# EAGLE design au6850_mp3 (EAGLE 9.0.0)
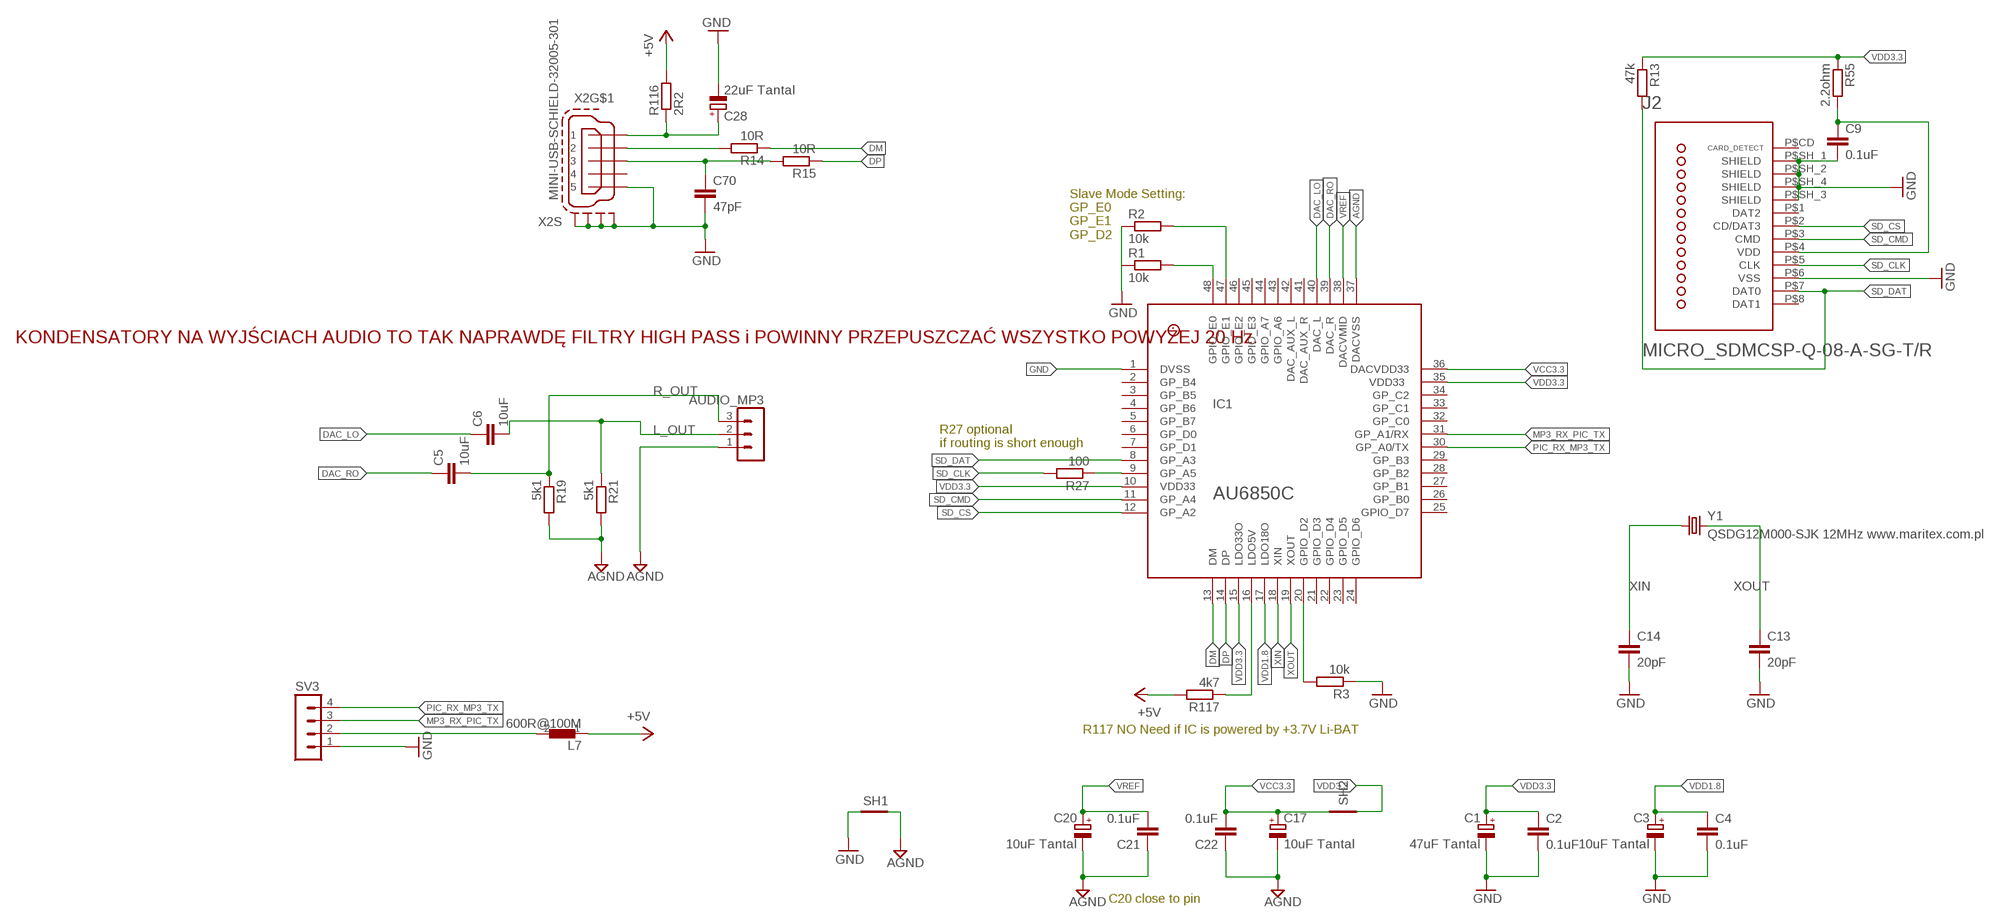
[diagram p0: schematic, sheet 1]

## Parts
AUDIO_MP3  MA03-1  [MA03-1]
C1  47uF Tantal  CPOL-EUB/3528-21R  [B/3528-21R]
C2  0.1uF  C-EUC0805  [C0805]
C3  10uF Tantal  CPOL-EUB/3528-21R  [B/3528-21R]
C4  0.1uF  C-EUC0805  [C0805]
C5  10uF  C-EUC0805  [C0805]
C6  10uF  C-EUC0805  [C0805]
C9  0.1uF  C-EUC0805  [C0805]
C13  20pF  C-EUC0805  [C0805]
C14  20pF  C-EUC0805  [C0805]
C17  10uF Tantal  CPOL-EUB/3528-21R  [B/3528-21R]
C20  10uF Tantal  CPOL-EUB/3528-21R  [B/3528-21R]
C21  0.1uF  C-EUC0805  [C0805]
C22  0.1uF  C-EUC0805  [C0805]
C28  22uF Tantal  CPOL-EUSMCA  [SMC_A]
C70  47pF  C-EUC0805  [C0805]
IC1  AU6850C  [LQFP48-7X7]
J2  MICRO_SDMCSP-Q-08-A-SG-T/R  [MICRO_SD_8PINS]
L7  600R@100M  FERRITR0805  [R0805]
R1  10k  R-EU_R0805  [R0805]
R2  10k  R-EU_R0805  [R0805]
R3  10k  R-EU_R0805  [R0805]
R13  47k  R-EU_R0805  [R0805]
R14  10R  R-EU_R0805  [R0805]
R15  10R  R-EU_R0805  [R0805]
R19  5k1  R-EU_R0805  [R0805]
R21  5k1  R-EU_R0805  [R0805]
R27  100  R-EU_R0805  [R0805]
R55  2.2ohm  R-EU_R0805  [R0805]
R116  2R2  R-EU_R0805  [R0805]
R117  4k7  R-EU_R0805  [R0805]
SH1  SHORT-HT5  [SHORT_TOP-50]
SH2  SHORT-V12_MILS  [12_MILS]
SV3  MA04-1  [MA04-1]
X2  MINI-USB-SCHIELD-32005-301  [32005-301]
Y1  QSDG12M000-SJK 12MHz www.maritex.com.pl  CRYSTALTXC-7A  [CRYSTAL-TXC-7A]

## Nets
+5V: L7.1 R116.2 R117.2
AGND: AUDIO_MP3.1 C17.- C20.- C21.1 C22.1 IC1.37(DACVSS) R19.2 R21.2 SH1.2
DAC_LO: C6.1 IC1.40(DAC_L)
DAC_RO: C5.1 IC1.39(DAC_R)
DM: IC1.13(DM) R14.1
DP: IC1.14(DP) R15.1
GND: C1.- C2.2 C3.- C4.2 C9.2 C13.2 C14.2 C28.- C70.2 IC1.1(DVSS) J2.P$6(VSS) J2.P$SH_1(1_GND_PAD) J2.P$SH_2(2_GND_PAD) J2.P$SH_3(3_GND_PAD) J2.P$SH_4(4_GND_PAD) R1.1 R2.1 R3.1 SH1.1 SV3.1 X2.5 X2.M1(S:S1) X2.M2(S:S2) X2.M3(S:S3) X2.M4(S:S4)
L_OUT: AUDIO_MP3.2 C6.2 R21.1
MP3_RX_PIC_TX: IC1.31(GP_A1/RX) SV3.3
N$4: IC1.16(LDO5V) R117.1
N$5: IC1.9(GP_A5) R27.1
N$8: C28.+ R116.1 X2.1
N$9: C70.1 R15.2 X2.3
N$10: R14.2 X2.2
N$13: L7.2 SV3.2
N$14: C9.1 J2.P$4(VDD) R55.2
PIC_RX_MP3_TX: IC1.30(GP_A0/TX) SV3.4
R_OUT: AUDIO_MP3.3 C5.2 R19.1
SD_CLK: J2.P$5(CLK) R27.2
SD_CMD: IC1.11(GP_A4) J2.P$3(CMD)
SD_CS: IC1.12(GP_A2) J2.P$2(CD/DAT3)
SD_DAT: IC1.8(GP_A3) J2.P$7(DAT0) R13.2
SLAVE_D2: IC1.20(GPIO_D2) R3.2
SLAVE_E0: IC1.48(GPIO_E0) R1.2
SLAVE_E1: IC1.47(GPIO_E1) R2.2
VCC3.3: C17.+ C22.2 IC1.36(DACVDD33) SH2.P$2
VDD1.8: C3.+ C4.1 IC1.17(LDO18O)
VDD3.3: C1.+ C2.1 IC1.10(VDD33) IC1.15(LDO33O) IC1.35(VDD33) R13.1 R55.1 SH2.P$1
VREF: C20.+ C21.2 IC1.38(DACVMID)
XIN: C14.1 IC1.18(XIN) Y1.P$1
XOUT: C13.1 IC1.19(XOUT) Y1.P$2
Unconnected: IC1.2(GP_B4) IC1.3(GP_B5) IC1.4(GP_B6) IC1.5(GP_B7) IC1.6(GP_D0) IC1.7(GP_D1) IC1.21(GPIO_D3) IC1.22(GPIO_D4) IC1.23(GPIO_D5) IC1.24(GPIO_D6) IC1.25(GPIO_D7) IC1.26(GP_B0) IC1.27(GP_B1) IC1.28(GP_B2) IC1.29(GP_B3) IC1.32(GP_C0) IC1.33(GP_C1) IC1.34(GP_C2) IC1.41(DAC_AUX_R) IC1.42(DAC_AUX_L) IC1.43(GPIO_A6) IC1.44(GPIO_A7) IC1.45(GPIO_E3) IC1.46(GPIO_E2) J2.P$1(DAT2) J2.P$8(DAT1) J2.P$CD(CARD_DETECT_SW) X2.4

## Notes on the sheet
- Slave Mode Setting:
  GP_E0
  GP_E1
  GP_D2
- KONDENSATORY NA WYJŚCIACH AUDIO TO TAK NAPRAWDĘ FILTRY HIGH PASS i POWINNY PRZEPUSZCZAĆ WSZYSTKO POWYŻEJ 20 Hz.
- R27 optional
  if routing is short enough
- R117 NO Need if IC is powered by +3.7V Li-BAT
- C20 close to pin

## Library data of the parts
AUDIO_MP3 = con-lstb:MA03-1: PIN HEADER; OC_FARNELL: unknown; OC_NEWARK: unknown
C1 C3 C17 C20 C28 = rcl:CPOL-EU: POLARIZED CAPACITOR, European symbol
C2 C4-C6 C21 C22 = rcl:C-EU: CAPACITOR, European symbol
C9 C13 C14 C70 = resistor:C-EU: CAPACITOR, European symbol
IC1 = mvsilicon:AU6850C
J2 = ADAM_TECH_SD_Card:MICRO_SD: Adam Tech
L7 = ferrit_bear:FERRIT
R1-R3 R13-R15 R19 R21 R27 R55 R116 R117 = rcl:R-EU_: RESISTOR, European symbol
SH1 = shorts-old:SHORT-H: Short between two nets; BOM: no
SH2 = shorts-old:SHORT-V: Short between two nets
SV3 = con-lstb:MA04-1: PIN HEADER; OC_FARNELL: unknown; OC_NEWARK: unknown
X2 = con-cypressindustries:MINI-USB-SCHIELD-: MINI USB-B Conector Source: www.cypressindustries.com; OC_FARNELL: unknown; OC_NEWARK: unknown
Y1 = SparkFun-FreqCtrl:CRYSTAL: Various standard crystals. Proven footprints. Spark Fun Electronics SKU : COM-00534

## Board
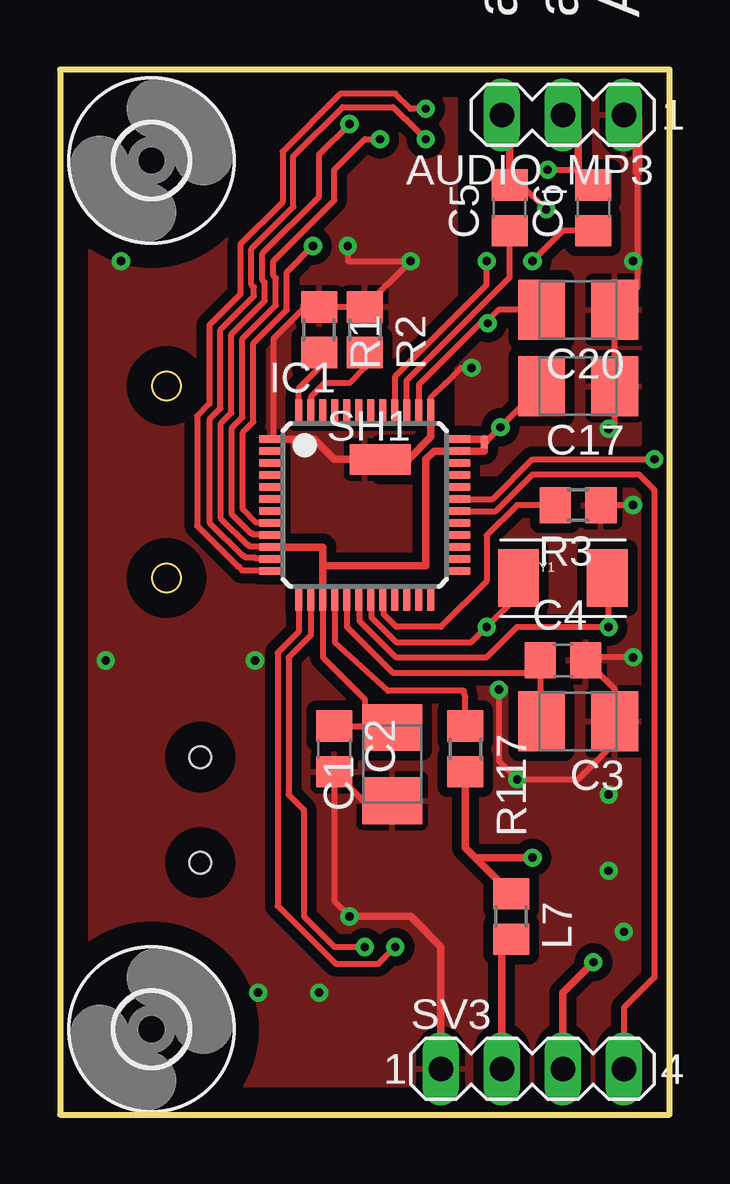
[diagram p1: board, top side]
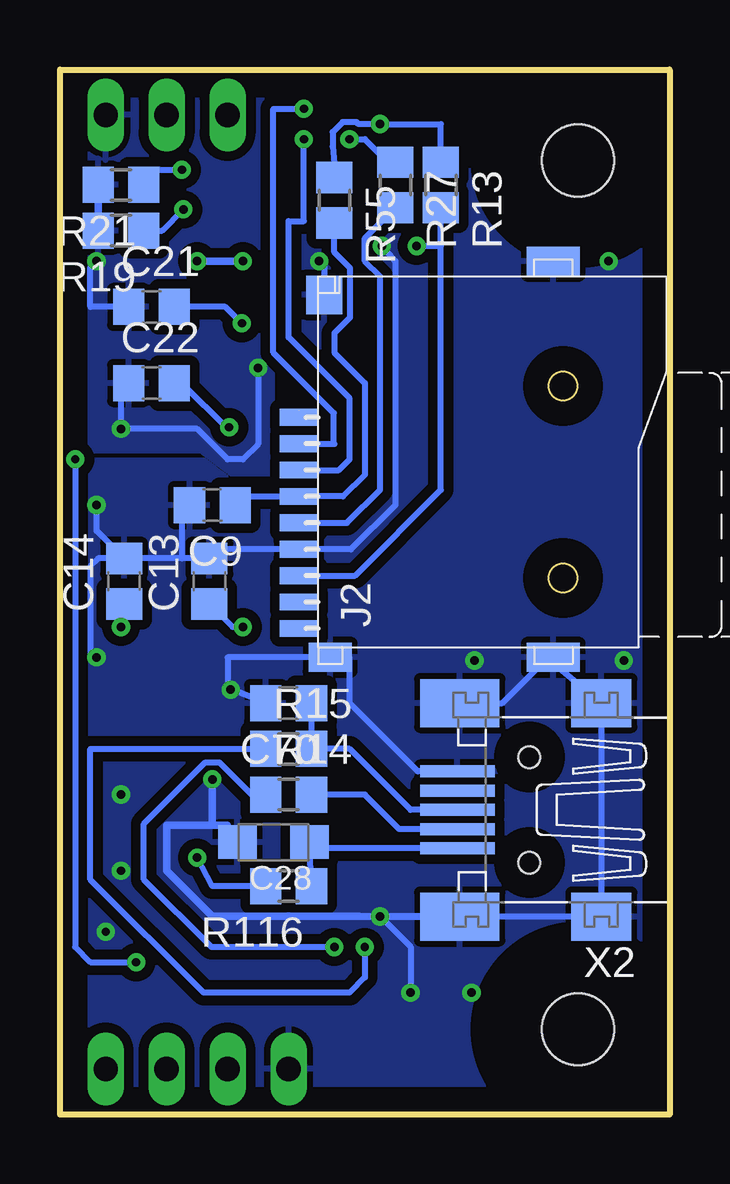
[diagram p2: board, bottom side, seen from below]

Size 25.4 x 43.54 mm. Coordinates in mm from the lower left corner, seen from the top.
Outline: 0,0 25.4,0 25.4,43.54 0,43.54 0,0
Copper layers (1*16): Top 0.035mm / dielectric 1.5mm / Bottom 0.035mm
Design rules "default *": minimum track width 10mil, minimum drill 24mil, track to track 8mil, track to pad 8mil, pad to pad 8mil, via to via 8mil, smd to smd 8mil, copper to edge 40mil, drill to drill 8mil, minimum pad ring 10mil, minimum via ring 8mil, stop-mask expansion 4mil, vias tented up to drill 0mil, thermal gap 10mil

### Footprints (pad centres in the part's own frame; a part is rotated, then mirrored left to right if it is on the bottom)
MA03-1 = drill 1.016 long: 1 -2.54,0; 2 0,0; 3 2.54,0
B/3528-21R = smd 1.95 x 2.5: + 1.525,0; - -1.525,0
C0805 = smd 1.3 x 1.5: 1 -0.95,0; 2 0.95,0
SMC_A = smd 1.6 x 1.4: + -1.5,0; - 1.5,0
LQFP48-7X7 = smd 0.9 x 0.3: 1 -3.95,2.75; 2 -3.95,2.25; 3 -3.95,1.75; 4 -3.95,1.25; 5 -3.95,0.75; 6 -3.95,0.25; 7 -3.95,-0.25; 8 -3.95,-0.75; 9 -3.95,-1.25; 10 -3.95,-1.75; 11 -3.95,-2.25; 12 -3.95,-2.75; 25 3.95,-2.75; 26 3.95,-2.25; 27 3.95,-1.75; 28 3.95,-1.25; 29 3.95,-0.75; 30 3.95,-0.25; 31 3.95,0.25; 32 3.95,0.75; 33 3.95,1.25; 34 3.95,1.75; 35 3.95,2.25; 36 3.95,2.75 | smd 0.3 x 0.9: 13 -2.75,-3.95; 14 -2.25,-3.95; 15 -1.75,-3.95; 16 -1.25,-3.95; 17 -0.75,-3.95; 18 -0.25,-3.95; 19 0.25,-3.95; 20 0.75,-3.95; 21 1.25,-3.95; 22 1.75,-3.95; 23 2.25,-3.95; 24 2.75,-3.95; 37 2.75,3.95; 38 2.25,3.95; 39 1.75,3.95; 40 1.25,3.95; 41 0.75,3.95; 42 0.25,3.95; 43 -0.25,3.95; 44 -0.75,3.95; 45 -1.25,3.95; 46 -1.75,3.95; 47 -2.25,3.95; 48 -2.75,3.95
MICRO_SD_8PINS = smd 0.7 x 1.6: P$1 1.75,11; P$2 0.65,11; P$3 -0.45,11; P$4 -1.55,11; P$5 -2.65,11; P$6 -3.75,11; P$7 -4.85,11; P$8 -5.95,11; P$CD -7.05,11 | smd 1.2 x 2.2: P$SH_1 -8.25,0.4; P$SH_2 8.25,0.4 | smd 1.2 x 1.8: P$SH_3 -8.25,9.7 | smd 1.6 x 1.5: P$SH_4 6.85,9.95
R0805 = smd 1.3 x 1.5: 1 -0.95,0; 2 0.95,0
SHORT_TOP-50 = smd 1.27 x 1.27: 1 0.635,0; 2 -0.635,0
12_MILS = smd 0.254 x 0.305: P$1 -0.127,0; P$2 0.127,0
MA04-1 = drill 1.016 long: 1 -3.81,0; 2 -1.27,0; 3 1.27,0; 4 3.81,0
3,0 = hole 3: 0,0
32005-301 = smd 3.1 x 0.5: 1 3,1.6; 2 3,0.8; 3 3,0; 4 3,-0.8; 5 3,-1.6 | smd 2.5 x 2: M1 -3,-4.45; M2 -3,4.45 | smd 3.3 x 2: M3 2.9,4.45; M4 2.9,-4.45 | hole 0.9: 0,2.2; 0,-2.2
CRYSTAL-TXC-7A = smd 1.7 x 2.4: P$1 1.85,0; P$2 -1.85,0

### Placement (x,y rotation side)
AUDIO_MP3  20.96,41.66 180 top
C1  13.84,14.61 90 top
C2  11.43,15.24 270 top
C3  21.59,16.38 180 top
C4  20.96,18.92 0 top
C5  18.73,37.78 90 top
C6  22.22,37.78 90 top
C9  19.05,25.4 180 bottom
C13  19.18,22.22 90 bottom
C14  22.73,22.22 90 bottom
C17  21.59,30.35 180 top
C20  21.59,33.53 180 top
C21  21.59,33.66 0 bottom
C22  21.59,30.48 0 bottom
C28  16.51,11.35 180 bottom
C70  15.87,17.14 180 bottom
IC1  12.7,25.4 0 top
J2  4.44,27.3 90 bottom
L7  18.8,8.25 270 top
R1  10.79,32.7 270 top
R2  12.7,32.7 270 top
R3  21.59,25.4 180 top
R13  9.52,38.73 270 bottom
R14  15.87,13.34 0 bottom
R15  15.87,15.24 0 bottom
R19  22.86,36.83 180 bottom
R21  22.86,38.73 180 bottom
R27  11.43,38.73 270 bottom
R55  13.97,38.1 270 bottom
R116  15.87,9.53 180 bottom
R117  16.89,15.24 270 top
SH1  13.33,27.3 180 top
SH2  17.68,28.03 90 top
SV3  19.68,1.91 0 top
U$1  [3,0]  3.81,39.75 0 top
U$2  [3,0]  3.81,3.56 0 top
X2  5.84,12.7 180 bottom
Y1  20.96,22.35 0 top

### Tracks (layer width: path | path; a pad name or v marks a point on that pad's centre or on a via)
+5V  (via drill 0.35)
  Top 0.305: R117.2 16.89,11.11 17.29,10.71 | 17.29,10.71 L7.1 | v19.68,10.71 17.29,10.71
  Bottom 0.254: R116.2 19.05,9.53 v19.68,10.71
AGND  (via drill 0.35)  (1 unrouted)
  Top 0.254: IC1.37 15.45,29.63 15.43,29.65 15.43,29.84 16.07,30.48 16.7,31.11 v17.14,31.11 | v22.86,28.57 23.11,28.83 C17.- C20.- 24.05,34.47 24.05,35.56 | 24.05,39.29 24.05,35.56 | v23.88,35.56 24.05,35.56
  Top 0.305: SH1.2 14.52,27.3 15.46,28.24 IC1.37
  Top 0.406: 24.05,41.59 24.05,39.29
  Bottom 0.254: C22.1 22.86,30.16 v22.86,28.57 19.68,28.57 18.41,27.3 17.78,27.3 17.14,27.94 v17.14,31.11 | 22.54,34.22 C21.1 24.13,33.66 24.13,35.31 v23.88,35.56
  Bottom 0.305: R19.2 R21.2
  pour Bottom (isolate 0.406): 16.51,44.45 16.51,26.67 18.29,26.67 19.56,27.62 27.3,27.62 27.3,44.45
  pour Top (isolate 0.406): 16.51,44.45 16.51,26.67 18.29,26.67 19.56,27.62 27.3,27.62 27.3,44.45
DAC_LO  (via drill 0.35)
  Top 0.254: IC1.40 13.97,29.37 13.97,30.77 17.78,34.58 v17.78,35.56 | C6.1 20.96,36.83 v19.68,35.56
  Bottom 0.305: v19.68,35.56 v17.78,35.56
DAC_RO
  Top 0.254: IC1.39 14.45,30.6 17.32,33.48 17.43,33.58 18.73,34.88 C5.1
DM  (via drill 0.35)
  Top 0.254: IC1.13 9.95,20.12 9.07,19.24 9.07,8.7 11.49,6.28 13.26,6.28 v13.97,6.99
  Bottom 0.254: R14.1 17.41,13.34 18.76,14.68 19.34,14.68 21.91,12.11 21.91,9.79 19.1,6.99 v13.97,6.99
DP  (via drill 0.35)
  Top 0.254: 10.43,21.43 IC1.14 10.45,19.97 9.52,19.05 9.52,13.34 10.16,12.7 10.16,8.25 11.43,6.99 v12.7,6.99
  Bottom 0.254: 12.97,6.99 v12.7,6.99 12.7,5.71 13.33,5.08 19.42,5.08 24.13,9.79 24.13,15.24 R15.1
GND  (via drill 0.35)
  Top 0.254: v23.88,25.4 R3.1 | v23.88,19.05 22.03,19.05 C4.2 23.11,17.71 C3.- 23.11,15.5 21.59,13.97 v19.05,13.97 18.29,14.73 v18.29,17.71 | C1.- 12.64,13.08 C2.2 11.43,8.89 v12.06,8.25 | v14.6,35.56 R2.1 R1.1 10.21,33.65 8.89,32.33 8.89,28.15 | v14.6,35.56 | v11.99,36.2 11.99,35.56 v14.6,35.56
  Top 0.305: IC1.1 8.89,28.15 10.58,28.15 11.43,27.3 SH1.1 | SV3.1 15.87,6.99 14.6,8.25 v12.06,8.25
  Bottom 0.254: X2.M3 X2.M2 X2.M1 5.1,19.02 | 20.32,23.18 C13.2 18.8,23.55 J2.P$6 13.27,23.55 11.43,25.4 11.43,35.56 v11.99,36.2 | 20.32,23.18 C14.2 | C14.2 23.88,24.32 v23.88,25.4 | 5.1,19.02 5.13,19.05 | C14.2 23.82,23.18 24.13,22.86 24.13,19.05 v23.88,19.05 | C70.2 18.41,17.78 | 18.41,17.78 v18.29,17.71 | 12.93,8.25 v12.06,8.25 10.79,6.99 v10.79,5.08 | C9.2 20.32,25.08 20.32,23.18 | v14.6,35.56 14.39,35.35 J2.P$SH_4 | 18.41,17.78 18.41,19.05 J2.P$SH_3 13.34,19.05 13.33,19.05 13.33,17.14 10.49,14.3 X2.5 | C28.- 18.01,11.62 18.44,12.05 | X2.M4 6.98,17.15 5.1,19.02
  Bottom 0.305: X2.M3 12.93,8.25 19.05,8.25 20.96,10.16 20.96,12.07 19.05,12.05 | 18.44,12.05 19.05,12.05 | v19.05,13.97 19.05,12.05
  other vias: 22.86,13.34 22.86,10.16 2.54,35.56 8.25,5.08 1.9,18.92 8.13,18.92 23.5,7.62
  pour Top (isolate 0.406): -0.32,44.45 16.51,44.45 16.51,26.35 18.1,26.35 19.37,27.3 26.99,27.3 26.99,0.64 26.67,0.95 -0.32,0.95
  pour Bottom (isolate 0.406): -0.32,44.45 16.51,44.45 16.51,26.35 18.1,26.35 19.37,27.3 28.26,27.3 28.26,0.95 -0.32,0.95
L_OUT  (via drill 0.35)
  Top 0.254: v20.32,39.37 21.59,39.37 C6.2
  Top 0.305: v20.32,39.37 | AUDIO_MP3.2 21.59,41.02 21.59,39.37
  Bottom 0.254: R21.1 21.27,39.37 v20.32,39.37
MP3_RX_PIC_TX  (via drill 0.35)
  Top 0.254: IC1.31 18.03,25.65 19.68,27.3 v24.76,27.3
  Top 0.305: v22.22,6.35 20.96,5.08 SV3.3
  Bottom 0.254: v24.76,27.3 24.76,6.99 24.13,6.35 v22.22,6.35
N$4
  Top 0.254: IC1.16 11.45,19.68 | 11.45,19.68 11.45,19.66 | R117.1 16.89,17.4 16.83,17.65 13.67,17.65 11.45,19.68
N$5  (via drill 0.35)
  Top 0.254: IC1.9 8.73,24.17 8.06,24.17 8.02,24.21 7.97,24.21 7.16,25.02 7.16,28.61 7.6,29.05 7.6,32.33 8.99,33.72 8.99,34.86 8.89,34.96 8.89,35.56 11.43,38.1 11.43,39.37 12.7,40.64 v13.33,40.64
  Bottom 0.254: v13.33,40.64 12.7,40.64 11.43,39.37 R27.1
N$8
  Bottom 0.254: C28.+ 15.01,11.43 | C28.+ 15.01,10.88 R116.1 | 14.68,11.35 C28.+ | X2.1 14.76,11.1 C28.+
N$9
  Bottom 0.254: C70.1 R15.2 | 15.31,15.62 R15.2 | X2.3 10.79,12.7 13.33,15.24 R15.2
N$10
  Bottom 0.254: 14.6,13.97 R14.2 12.7,13.34 11.26,11.9 X2.2
N$13
  Top 0.305: SV3.2 18.41,6.92 L7.2
N$14
  Bottom 0.254: C9.1 17.75,25.75 J2.P$4 13.61,25.75 12.7,26.67 12.7,30.48 13.97,31.75 13.97,32.56 13.31,33.22 13.31,35.27 13.97,35.93 R55.2
PIC_RX_MP3_TX
  Top 0.254: 16.67,25.13 IC1.30 18.16,25.15 19.68,26.67 24.13,26.67 24.76,26.04 24.76,5.71 23.5,4.45 SV3.4
R_OUT  (via drill 0.35)
  Top 0.254: v20.26,37.72 19.25,38.73 18.99,38.73
  Top 0.305: 18.99,38.73 C5.2 18.73,41.34 AUDIO_MP3.3
  Bottom 0.254: R19.1 21.15,36.83 v20.26,37.72
SD_CLK
  Bottom 0.254: R27.2 12.7,36.52 12.7,35.56 12.06,34.92 12.06,26.04 13.44,24.65 J2.P$5
SD_CMD  (via drill 0.35)
  Top 0.254: IC1.11 8.73,23.17 8.17,23.17 8.12,23.21 7.72,23.21 7.64,23.3 7.59,23.3 6.25,24.64 6.25,28.99 6.68,29.43 6.68,32.71 8.08,34.1 8.08,34.48 7.98,34.58 7.98,36.07 9.73,37.83 9.73,39.94 11.77,41.98 13.88,41.98 14.42,41.45 14.43,41.45 v15.24,40.64
  Bottom 0.254: v15.24,40.64 15.24,37.23 15.87,37.23 15.87,32.38 13.33,29.84 13.33,27.3 13.79,26.86 J2.P$3
SD_CS  (via drill 0.35)
  Top 0.254: IC1.12 8.73,22.67 7.62,22.67 | 7.62,22.67 7.58,22.67 | v15.24,41.91 14.6,41.91 13.97,42.55 11.69,42.55 9.27,40.13 9.27,38.02 7.52,36.26 7.52,34.19 6.23,32.9 6.23,29.62 5.71,29.11 5.71,24.53 7.41,22.84 7.45,22.84 7.62,22.67
  Bottom 0.254: J2.P$2 13.98,27.95 | 13.98,27.95 13.97,27.94 | 13.98,27.95 13.98,29.22 16.51,31.75 16.51,41.91 v15.24,41.91
SD_DAT  (via drill 0.35)
  Top 0.254: IC1.8 8.73,24.67 8.16,24.67 7.62,25.21 7.62,28.43 8.05,28.86 8.05,32.14 9.45,33.53 9.45,35.1 v10.54,36.2
  Bottom 0.254: J2.P$7 13.1,22.45 9.52,26.04 9.52,36.2 | 9.52,36.2 R13.2 | v10.54,36.2 9.52,36.2
SLAVE_D2
  Top 0.254: IC1.20 13.47,21.43 13.47,20.86 14.01,20.32 15.87,20.32 17.78,22.22 17.78,24.13 19.05,25.4 R3.2
SLAVE_E0
  Top 0.254: IC1.48 9.95,30.27 10.79,31.11 R1.2
SLAVE_E1
  Top 0.254: IC1.47 10.47,29.37 10.47,29.94 11.01,30.48 12.06,30.48 12.7,31.11 R2.2
VCC3.3  (via drill 0.35)
  Top 0.254: SH2.P$2 17.87,28.16 v18.35,28.64 C17.+
  Top 0.305: IC1.36 SH2.P$2 | SH2.P$2 | 17.76,28.07 SH2.P$2
  Bottom 0.254: C22.2 20.32,30.48 18.41,28.57 v18.35,28.64
VDD1.8
  Top 0.254: IC1.17 11.95,20.32 13.85,18.41 19.5,18.41 C4.1 20,16.44 C3.+
VDD3.3  (via drill 0.35)
  Top 0.254: 10.93,21.43 IC1.15 10.95,19.05 11.19,18.81 11.43,18.57 12.7,17.3 12.7,16.19 | C2.1 12.7,16.19 | 12.7,16.19 14.42,16.19 C1.+ | IC1.10 8.73,23.67 7.91,23.67 7.83,23.75 7.78,23.75 6.71,24.83 6.71,28.8 7.14,29.24 7.14,32.52 8.53,33.91 8.53,34.67 8.43,34.77 8.43,35.88 10.79,38.25 10.79,40.01 v12.06,41.27
  Top 0.305: 10.95,22.86 10.95,23.65 IC1.10 | 10.95,22.86 IC1.15 | 10.95,22.86 15.24,22.86 15.24,27.3 15.58,27.65 IC1.35 17.68,27.65 SH2.P$1
  Bottom 0.254: R13.1 9.52,41.27 v12.06,41.27 12.97,41.27 13.04,41.35 13.63,41.35 14.04,40.93 14.04,40.35 13.97,39.64 R55.1
VREF  (via drill 0.35)
  Top 0.254: IC1.38 14.97,29.37 14.97,30.43 17.52,32.98 v17.82,32.98 17.78,33.02 18.29,33.53 C20.+
  Bottom 0.254: v17.82,32.98 18.5,33.66 C21.2
XIN  (via drill 0.35)
  Top 0.254: IC1.18 12.47,21.43 12.47,20.57 13.98,19.06 17.79,19.06 19.05,20.32 v22.86,20.32 22.86,22.3 Y1.P$1
  Bottom 0.254: 22.73,20.83 C14.1 22.73,20.45 v22.86,20.32
XOUT  (via drill 0.35)
  Top 0.254: IC1.19 12.97,21.43 12.97,20.72 14,19.68 17.14,19.68 v17.78,20.32 19.11,21.64 Y1.P$2
  Bottom 0.254: C13.1 18.22,20.32 v17.78,20.32

### Text on the board
tPlace: audio left channel output | audio right channel output | AGND